# EAGLE schematic WCS1500_PCB (EAGLE 7.5.0)
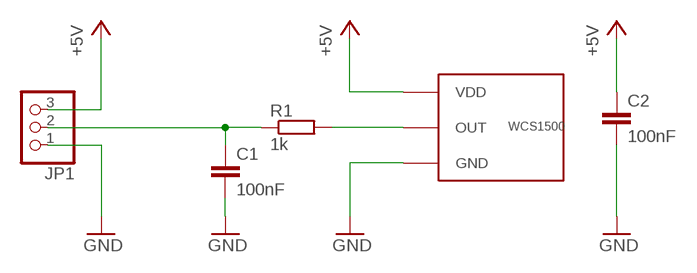
[diagram p0: schematic, sheet 1]

## Parts
C1  100nF  C-EUC0603  [C0603]
C2  100nF  C-EUC0603  [C0603]
JP1  PINHD-1X3  [1X03]
R1  1k  R-EU_R0603  [R0603]
U$1  WCS1500  [WCS1500]

## Nets
+5V: C2.1 JP1.3 U$1.VDD
GND: C1.2 C2.2 JP1.1 U$1.GND
N$1: R1.2 U$1.OUT
N$2: C1.1 JP1.2 R1.1

## Library data of the parts
C1 C2 = resistor:C-EU: CAPACITOR, European symbol
JP1 = pinhead:PINHD-1X3: PIN HEADER
R1 = resistor:R-EU_: RESISTOR, European symbol
U$1 = _marek:WCS1500